# Altium schematic sheet ESP32 S3 MINI.SchDoc
size 389 x 241 mm; SheetNumber: 6; SheetTotal: 14
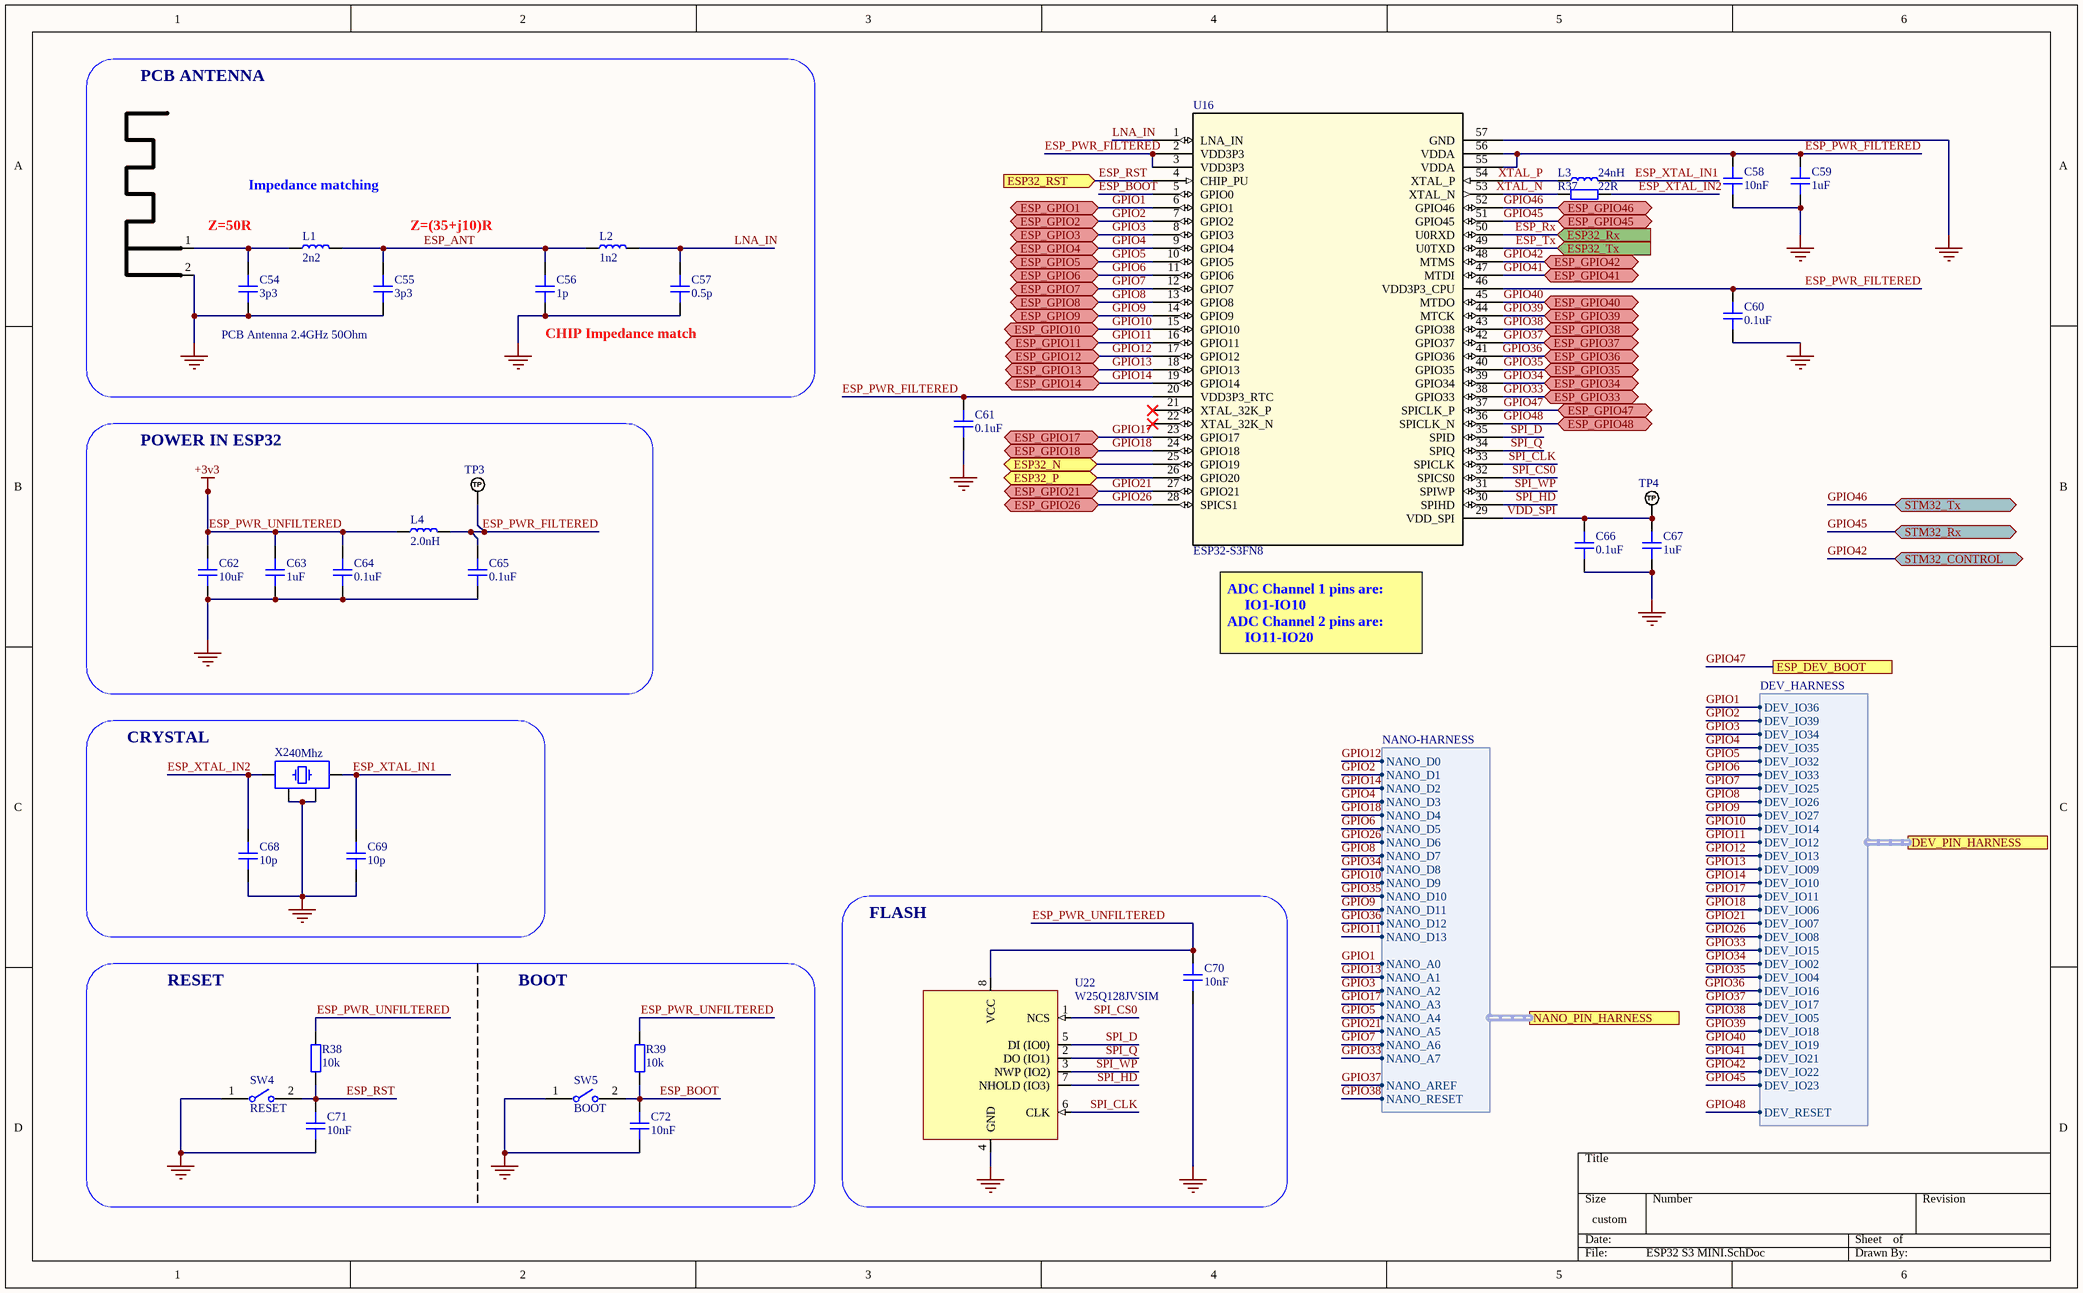
[diagram p0: ESP32 S3 MINI.SchDoc]

## Parts
ANT1  PCB Antenna 2.4GHz 50Ohm  [ANT_IFA_USB_2_4GHZ_50R]  (no BOM)
C54  3p3  [CAP_0603]
C55  3p3  [CAP_0603]
C56  1p  [CAP_0603]
C57  0.5p  [CAP_0603]
C58  10nF  [CAP_0603]
C59  1uF  [CAP_0603]
C60  0.1uF  [CAP_0603]
C61  0.1uF  [CAP_0603]
C62  10uF  [CAP_0603]
C63  1uF  [CAP_0603]
C64  0.1uF  [CAP_0603]
C65  0.1uF  [CAP_0603]
C66  0.1uF  [CAP_0603]
C67  1uF  [CAP_0603]
C68  10p  [CAP_0603]
C69  10p  [CAP_0603]
C70  10nF  [CAP_0603]
C71  10nF  [CAP_0603]
C72  10nF  [CAP_0603]
L1  2n2  [IND_0603]
L2  1n2  [IND_0603]
L3  24nH  [IND_0603]
L4  2.0nH  [IND_0603]
R37  22R  [RES_0603]
R38  10k  [RES_0603]
R39  10k  [RES_0603]
SW4  RESET  [FP-B3U-1000P-MFG]
SW5  BOOT  [FP-B3U-1000P-MFG]
TP3  TP_NOBOM  [PAD_RND_1MM]  (value not drawn)  (no BOM)
TP4  TP_NOBOM  [PAD_RND_1MM]  (value not drawn)  (no BOM)
U16  ESP32-S3FN8  [QFN56_7X7_EXP]
U22  W25Q128JVSIM  [SOIC-8]
X2  40Mhz  [XTAL_3225]

## Blocks framed on the sheet
PCB ANTENNA: ANT1 C54-C57 L1 L2
POWER IN ESP32: C62-C65 L4 TP3
CRYSTAL: C68 C69 X2
FLASH: C70 U22

## Ports
DEV_PIN_HARNESS (harness DEV_HARNESS), ESP32_N (bidir), ESP32_P (bidir), ESP32_RST (in), ESP32_Rx (in), ESP32_Tx (in), ESP_DEV_BOOT, ESP_GPIO1 (bidir), ESP_GPIO2 (bidir), ESP_GPIO3 (bidir), ESP_GPIO4 (bidir), ESP_GPIO5 (bidir), ESP_GPIO6 (bidir), ESP_GPIO7 (bidir), ESP_GPIO8 (bidir), ESP_GPIO9 (bidir), ESP_GPIO10 (bidir), ESP_GPIO11 (bidir), ESP_GPIO12 (bidir), ESP_GPIO13 (bidir), ESP_GPIO14 (bidir), ESP_GPIO17 (bidir), ESP_GPIO18 (bidir), ESP_GPIO21 (bidir), ESP_GPIO26 (bidir), ESP_GPIO33 (bidir), ESP_GPIO34 (bidir), ESP_GPIO35 (bidir), ESP_GPIO36 (bidir), ESP_GPIO37 (bidir), ESP_GPIO38 (bidir), ESP_GPIO39 (bidir), ESP_GPIO40 (bidir), ESP_GPIO41 (bidir), ESP_GPIO42 (bidir), ESP_GPIO45 (bidir), ESP_GPIO46 (bidir), ESP_GPIO47 (bidir), ESP_GPIO48 (bidir), NANO_PIN_HARNESS (harness NANO-HARNESS), STM32_CONTROL (bidir), STM32_Rx (bidir), STM32_Tx (bidir)

## Harnesses
NANO-HARNESS: NANO_D0, NANO_D1, NANO_D3, NANO_D4, NANO_D5, NANO_D6, NANO_D7, NANO_D8, NANO_D9, NANO_D10, NANO_D11, NANO_D12, NANO_D13, NANO_A0, NANO_A1, NANO_A2, NANO_A3, NANO_A4, NANO_A5, NANO_A6, NANO_A7, NANO_AREF, NANO_RESET, NANO_D2
DEV_HARNESS: DEV_IO36, DEV_IO39, DEV_IO34, DEV_IO35, DEV_IO32, DEV_IO33, DEV_IO25, DEV_IO26, DEV_IO27, DEV_IO14, DEV_IO12, DEV_IO13, DEV_IO09, DEV_IO10, DEV_IO11, DEV_IO06, DEV_IO07, DEV_IO08, DEV_IO15, DEV_IO02, DEV_IO04, DEV_IO16, DEV_IO17, DEV_IO05, DEV_IO18, DEV_IO19, DEV_IO21, DEV_IO22, DEV_IO23, DEV_RESET

## Nets
ESP_PWR_UNFILTERED: C62.2 C63.2 C64.2 C70.2 L4.1 R38.2 R39.2 U22.8(VCC)  [also labelled +3v3]
GND: ANT1.2(GND) C54.1 C55.1 C56.1 C57.1 C58.1 C59.1 C60.1 C61.1 C62.1 C63.1 C64.1 C65.1 C66.1 C67.1 C68.1 C69.1 C70.1 C71.1 C72.1 SW4.1 SW5.1 U16.57(GND) U22.4(GND) X2.2 X2.4
\: U16.43(GPIO38) ; port ESP_GPIO38, port NANO_PIN_HARNESS.NANO_RESET, port DEV_PIN_HARNESS.DEV_IO05  [also labelled GPIO38]
ESP32_N: U16.25(GPIO19) ; port ESP32_N
ESP32_P: U16.26(GPIO20) ; port ESP32_P
ESP_ANT: C55.2 C56.2 L1.2 L2.1
ESP_BOOT: C72.2 R39.1 SW5.2 U16.5(GPIO0)
ESP_PWR_FILTERED: C58.2 C59.2 C60.2 C61.2 C65.2 L4.2 TP3.1(TP) U16.2(VDD3P3) U16.3(VDD3P3) U16.20(VDD3P3_RTC) U16.46(VDD3P3_CPU) U16.55(VDDA) U16.56(VDDA)
ESP_RST: C71.2 R38.1 SW4.2 U16.4(CHIP_PU) ; port ESP32_RST
ESP_Rx: U16.50(U0RXD) ; port ESP32_Rx
ESP_Tx: U16.49(U0TXD) ; port ESP32_Tx
ESP_XTAL_IN1: C69.2 L3.2 X2.3
ESP_XTAL_IN2: C68.2 R37.1 X2.1
GPIO1: U16.6(GPIO1) ; port ESP_GPIO1, port NANO_PIN_HARNESS.NANO_A0, port DEV_PIN_HARNESS.DEV_IO36
GPIO2: U16.7(GPIO2) ; port ESP_GPIO2, port NANO_PIN_HARNESS.NANO_D1, port DEV_PIN_HARNESS.DEV_IO39
GPIO3: U16.8(GPIO3) ; port ESP_GPIO3, port NANO_PIN_HARNESS.NANO_A2, port DEV_PIN_HARNESS.DEV_IO34
GPIO4: U16.9(GPIO4) ; port ESP_GPIO4, port NANO_PIN_HARNESS.NANO_D3, port DEV_PIN_HARNESS.DEV_IO35
GPIO5: U16.10(GPIO5) ; port ESP_GPIO5, port NANO_PIN_HARNESS.NANO_A4, port DEV_PIN_HARNESS.DEV_IO32
GPIO6: U16.11(GPIO6) ; port ESP_GPIO6, port NANO_PIN_HARNESS.NANO_D5, port DEV_PIN_HARNESS.DEV_IO33
GPIO7: U16.12(GPIO7) ; port ESP_GPIO7, port NANO_PIN_HARNESS.NANO_A6, port DEV_PIN_HARNESS.DEV_IO25
GPIO8: U16.13(GPIO8) ; port ESP_GPIO8, port NANO_PIN_HARNESS.NANO_D7, port DEV_PIN_HARNESS.DEV_IO26
GPIO9: U16.14(GPIO9) ; port ESP_GPIO9, port NANO_PIN_HARNESS.NANO_D11, port DEV_PIN_HARNESS.DEV_IO27
GPIO10: U16.15(GPIO10) ; port ESP_GPIO10, port NANO_PIN_HARNESS.NANO_D9, port DEV_PIN_HARNESS.DEV_IO14
GPIO11: U16.16(GPIO11) ; port ESP_GPIO11, port NANO_PIN_HARNESS.NANO_D13, port DEV_PIN_HARNESS.DEV_IO12
GPIO12: U16.17(GPIO12) ; port ESP_GPIO12, port NANO_PIN_HARNESS.NANO_D0, port DEV_PIN_HARNESS.DEV_IO13
GPIO13: U16.18(GPIO13) ; port ESP_GPIO13, port NANO_PIN_HARNESS.NANO_A1, port DEV_PIN_HARNESS.DEV_IO09
GPIO14: U16.19(GPIO14) ; port ESP_GPIO14, port NANO_PIN_HARNESS.NANO_D2, port DEV_PIN_HARNESS.DEV_IO10
GPIO17: U16.23(GPIO17) ; port ESP_GPIO17, port NANO_PIN_HARNESS.NANO_A3, port DEV_PIN_HARNESS.DEV_IO11
GPIO18: U16.24(GPIO18) ; port ESP_GPIO18, port NANO_PIN_HARNESS.NANO_D4, port DEV_PIN_HARNESS.DEV_IO06
GPIO21: U16.27(GPIO21) ; port ESP_GPIO21, port NANO_PIN_HARNESS.NANO_A5, port DEV_PIN_HARNESS.DEV_IO07
GPIO26: U16.28(SPICS1) ; port ESP_GPIO26, port NANO_PIN_HARNESS.NANO_D6, port DEV_PIN_HARNESS.DEV_IO08
GPIO33: U16.38(GPIO33) ; port ESP_GPIO33, port NANO_PIN_HARNESS.NANO_A7, port DEV_PIN_HARNESS.DEV_IO15
GPIO34: U16.39(GPIO34) ; port ESP_GPIO34, port NANO_PIN_HARNESS.NANO_D8, port DEV_PIN_HARNESS.DEV_IO02
GPIO35: U16.40(GPIO35) ; port ESP_GPIO35, port NANO_PIN_HARNESS.NANO_D10, port DEV_PIN_HARNESS.DEV_IO04
GPIO36: U16.41(GPIO36) ; port ESP_GPIO36, port NANO_PIN_HARNESS.NANO_D12, port DEV_PIN_HARNESS.DEV_IO16
GPIO37: U16.42(GPIO37) ; port ESP_GPIO37, port NANO_PIN_HARNESS.NANO_AREF, port DEV_PIN_HARNESS.DEV_IO17
GPIO39: U16.44(MTCK) ; port ESP_GPIO39, port DEV_PIN_HARNESS.DEV_IO18
GPIO40: U16.45(MTDO) ; port ESP_GPIO40, port DEV_PIN_HARNESS.DEV_IO19
GPIO41: U16.47(MTDI) ; port ESP_GPIO41, port DEV_PIN_HARNESS.DEV_IO21
GPIO42: U16.48(MTMS) ; port ESP_GPIO42, port STM32_CONTROL, port DEV_PIN_HARNESS.DEV_IO22
GPIO45: U16.51(GPIO45) ; port ESP_GPIO45, port STM32_Rx, port DEV_PIN_HARNESS.DEV_IO23
GPIO46: U16.52(GPIO46) ; port ESP_GPIO46, port STM32_Tx
GPIO47: U16.37(SPICLK_P) ; port ESP_GPIO47, port ESP_DEV_BOOT
GPIO48: U16.36(SPICLK_N) ; port ESP_GPIO48, port DEV_PIN_HARNESS.DEV_RESET
LNA_IN: C57.2 L2.2 U16.1(LNA_IN)
SPI_CLK: U16.33(SPICLK) U22.6(CLK)
SPI_CS0: U16.32(SPICS0) U22.1(NCS)
SPI_D: U16.35(SPID) U22.5(DI_(IO0))
SPI_HD: U16.30(SPIHD) U22.7(NHOLD_(IO3))
SPI_Q: U16.34(SPIQ) U22.2(DO_(IO1))
SPI_WP: U16.31(SPIWP) U22.3(NWP_(IO2))
VDD_SPI: C66.2 C67.2 TP4.1(TP) U16.29(VDD_SPI)
XTAL_N: R37.2 U16.53(XTAL_N)
XTAL_P: L3.1 U16.54(XTAL_P)
NetANT1_1: ANT1.1(RF) C54.2 L1.1

Not connected (* = marked no-connect by the designer): U16 21(XTAL_32K_P)* 22(XTAL_32K_N)*

## Notes on the sheet
- Z=50R
- Impedance matching
- Z=(35+j10)R
- CHIP Impedance match
- ADC Channel 1 pins are:
  IO1-IO10
  ADC Channel 2 pins are:
  IO11-IO20
- RESET
- BOOT

## Library data of the parts
ANT1 = ANT_IFA_USB_2_4GHZ_50R: Inverted F 2.4GHz ISM PCB Antenna 50 Ohm; ComponentLink1Description: Datasheet; ComponentLink1URL: https://www.ti.com/lit/an/swra117d/swra117d.pdf
C54-C72 = CAP_0603: Capacitor SMD 0603; Manufacturer: *; Manufacturer Part Number: *; Distributor Link: *; LCSC: *; Rating: *; Dielectric: *
L1-L4 = IND_0603: Inductor SMD 0603
R37-R39 = RES_0603: Resistor SMD 0603; Manufacturer: *; Manufacturer Part Number: *; Distributor Link: *; LCSC: *
SW4 SW5 = CMP-2100-03586-2: SWITCH TACTILE SPST-NO 0.05A 12V; Contact Resistance: 100mR; Operating Force: 1.5N; Max Current Rating: 50mA; Switch Travel: 0.15mm; Actuator Type: Standard; Mechanical Life: 200000Cycles; Ratings: Dust Proof; Illumination Type: Non-Illuminated; Throw Configuration: SPST; Actuator Length: 0.4mm; Switch Function: Off-Mom; Height: 1.2mm; Width: 3mm; Weight: 0.000776oz; Contact Material: Silver; Max Voltage Rating (DC): 12V; Insulation Resistance: 100MR; Lead Free: Lead Free; Current Rating: 50mA; Termination: SMD/SMT; Length: 4mm; Voltage Rating (DC): 12V; Contact Current Rating: 50mA; Orientation: Straight; Depth: 2.5mm; Max Operating Temperature: 70°C; Packaging: Tape and Reel; Min Operating Temperature: -25°C; Package Quantity: 1; Mount: Surface Mount; Electrical Life: 200000Cycles
TP3 TP4 = TEST_POINT_RND_1MM: Test Point Round 1mm (NO BOM)
U16 = ESP32-S3FN8: No Description Available; Manufacturer_Name: Espressif Systems; Copyright: Copyright (C) 2025 Ultra Librarian. All rights reserved.; Manufacturer_Part_Number: ESP32-S3FN8; RefDes: RefDes; Type: Type
U22 = W25Q128JVSIM: 128M-BIT / SERIAL FLASH MEMORY WITH / DUAL/QUAD SPI & QPI & DTR SOIC-8; Manufacturer: Winbond; Manufacturer Part Number: W25Q128JVSIM
X2 = TSX-3225_24.0000MF15X-AC: Crystal SMD 24MHz 10PPM 7pF 3225; Manufacturer: Epson; Manufacturer Part Number: TSX-3225 24.0000MF15X-AC